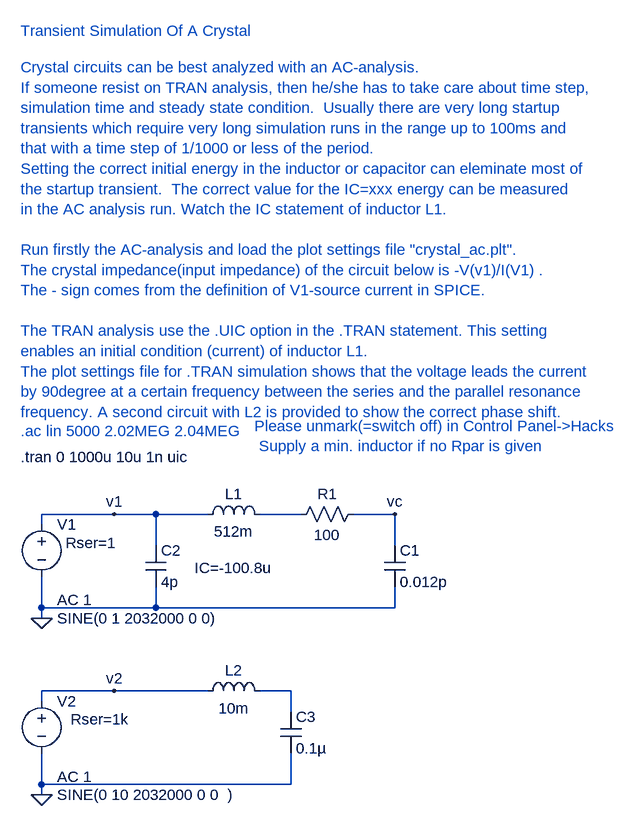
[diagram p0: schematic Crystal.asc]
Crystal.asc, the LTspice schematic file:
Version 4
SHEET 1 1144 680
WIRE 32 160 -48 160
WIRE -224 160 -224 176
WIRE -48 208 -48 160
WIRE -48 160 -112 160
WIRE -48 272 -48 304
WIRE -224 256 -224 304
WIRE -224 304 -48 304
WIRE -48 304 320 304
WIRE 320 304 320 272
WIRE 320 208 320 160
WIRE 320 160 256 160
WIRE 176 160 112 160
WIRE -224 320 -224 304
WIRE 32 432 -112 432
WIRE -224 432 -224 448
WIRE -224 528 -224 576
WIRE -224 576 160 576
WIRE -224 592 -224 576
WIRE 112 432 160 432
WIRE 160 432 160 464
WIRE -112 160 -224 160
WIRE -112 432 -224 432
WIRE 160 528 160 576
FLAG -224 320 0
FLAG -224 592 0
FLAG -112 160 v1
FLAG -112 432 v2
FLAG 320 160 vc
SYMBOL ind 16 176 R270
WINDOW 0 32 56 VTop 0
WINDOW 3 5 56 VBottom 0
WINDOW 39 -23 56 VBottom 0
WINDOW 40 -51 56 VBottom 0
SYMATTR InstName L1
SYMATTR Value 512m
SYMATTR SpiceLine2 IC=-100.8u
SYMBOL res 160 176 R270
WINDOW 0 32 56 VTop 0
WINDOW 3 0 56 VBottom 0
SYMATTR InstName R1
SYMATTR Value 100
SYMBOL cap 304 208 R0
SYMATTR InstName C1
SYMATTR Value 0.012p
SYMBOL cap -64 208 R0
SYMATTR InstName C2
SYMATTR Value 4p
SYMBOL voltage -224 160 R0
WINDOW 3 24 160 Left 0
WINDOW 123 24 132 Left 0
WINDOW 39 37 44 Left 0
SYMATTR Value SINE(0 1 2032000 0 0)
SYMATTR Value2 AC 1
SYMATTR SpiceLine Rser=1
SYMATTR InstName V1
SYMBOL ind 16 448 R270
WINDOW 0 32 56 VTop 0
WINDOW 3 5 56 VBottom 0
SYMATTR InstName L2
SYMATTR Value 10m
SYMATTR SpiceLine IC=0
SYMBOL voltage -224 432 R0
WINDOW 3 24 160 Left 0
WINDOW 123 24 132 Left 0
WINDOW 39 45 44 Left 0
SYMATTR Value SINE(0 10 2032000 0 0  )
SYMATTR Value2 AC 1
SYMATTR SpiceLine Rser=1k
SYMATTR InstName V2
SYMBOL cap 144 464 R0
SYMATTR InstName C3
SYMATTR Value 0.1µ
TEXT -256 32 Left 0 ;.ac lin 5000 2.02MEG 2.04MEG
TEXT -256 72 Left 0 !.tran 0 1000u 10u 1n uic
TEXT -256 -528 Left 0 ;Crystal circuits can be best analyzed with an AC-analysis.\nIf someone resist on TRAN analysis, then he/she has to take care about time step,\nsimulation time and steady state condition.  Usually there are very long startup \ntransients which require very long simulation runs in the range up to 100ms and\nthat with a time step of 1/1000 or less of the period.\nSetting the correct initial energy in the inductor or capacitor can eleminate most of \nthe startup transient.  The correct value for the IC=xxx energy can be measured\nin the AC analysis run. Watch the IC statement of inductor L1.\n \nRun firstly the AC-analysis and load the plot settings file "crystal_ac.plt".\nThe crystal impedance(input impedance) of the circuit below is -V(v1)/I(V1) .\nThe - sign comes from the definition of V1-source current in SPICE.\n \nThe TRAN analysis use the .UIC option in the .TRAN statement. This setting\nenables an initial condition (current) of inductor L1.\nThe plot settings file for .TRAN simulation shows that the voltage leads the current\nby 90degree at a certain frequency between the series and the parallel resonance \nfrequency. A second circuit with L2 is provided to show the correct phase shift.
TEXT -256 -584 Left 0 ;Transient Simulation Of A Crystal
TEXT 104 24 Left 0 ;Please unmark(=switch off) in Control Panel->Hacks\n Supply a min. inductor if no Rpar is given

The netlist it stands for:
* Crystal.asc
L1 v1 N001 512m IC=-100.8u
R1 N001 vc 100
C1 vc 0 0.012p
C2 v1 0 4p
V1 v1 0 SINE(0 1 2032000 0 0) AC 1 Rser=1
L2 v2 N002 10m IC=0
V2 v2 0 SINE(0 10 2032000 0 0  ) AC 1 Rser=1k
C3 N002 0 0.1µ
* .ac lin 5000 2.02MEG 2.04MEG
.tran 0 1000u 10u 1n uic
* Crystal circuits can be best analyzed with an AC-analysis.
* If someone resist on TRAN analysis, then he/she has to take care about time step,
* simulation time and steady state condition.  Usually there are very long startup
* transients which require very long simulation runs in the range up to 100ms and
* that with a time step of 1/1000 or less of the period.
* Setting the correct initial energy in the inductor or capacitor can eleminate most of
* the startup transient.  The correct value for the IC=xxx energy can be measured
* in the AC analysis run. Watch the IC statement of inductor L1.
* Run firstly the AC-analysis and load the plot settings file "crystal_ac.plt".
* The crystal impedance(input impedance) of the circuit below is -V(v1)/I(V1) .
* The - sign comes from the definition of V1-source current in SPICE.
* The TRAN analysis use the .UIC option in the .TRAN statement. This setting
* enables an initial condition (current) of inductor L1.
* The plot settings file for .TRAN simulation shows that the voltage leads the current
* by 90degree at a certain frequency between the series and the parallel resonance
* frequency. A second circuit with L2 is provided to show the correct phase shift.
* Transient Simulation Of A Crystal
* Please unmark(=switch off) in Control Panel->Hacks
*  Supply a min. inductor if no Rpar is given
.backanno
.end